# Altium project Circuits.PrjPcb
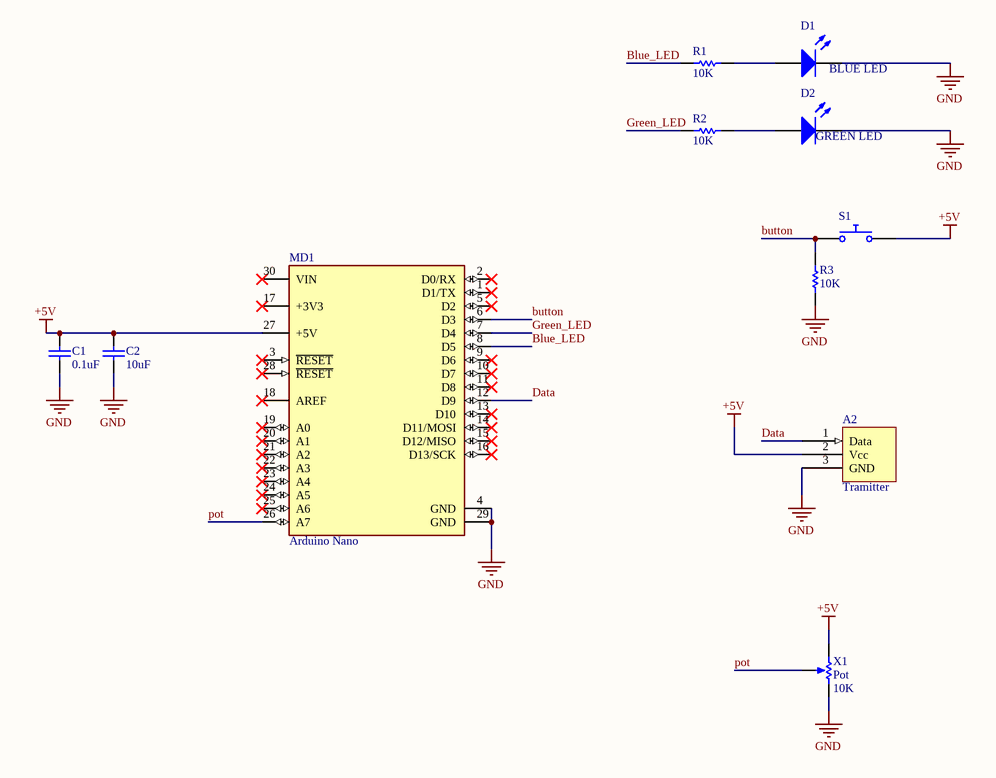
[diagram p0: transmitter.SchDoc]
1 sheet, 11 parts. Net scope: global (net labels, ports and power ports of the same name join across sheets).

## Sheet transmitter.SchDoc
size A4; SheetNumber: 1; SheetTotal: 1

### Parts
A2  Tramitter
C1  value 0.1uF  (hidden comment: Capacitor)
C2  value 10uF  (hidden comment: Capacitor)
D1  BLUE LED
D2  GREEN LED
MD1  Arduino Nano  [FP-A000005-MFG]
R1  value 10K  (hidden comment: Resistor)
R2  value 10K  (hidden comment: Resistor)
R3  value 10K  (hidden comment: Resistor)
S1  Push Button Normally Opened  (value not drawn)
X1  Pot  value 10K

### Nets
+5V: A2.2(Vcc) C1.2 C2.2 MD1.27(+5V) S1.2 X1.1(TOP)
GND: A2.3(GND) C1.1 C2.1 D1.2(K) D2.2(K) MD1.4(GND) MD1.29(GND) R3.1 X1.2(BOT)
Blue_LED: MD1.8(D5) R1.1
button: MD1.6(D3) R3.2 S1.1
Data: A2.1(Data) MD1.12(D9)
Green_LED: MD1.7(D4) R2.1
pot: MD1.26(A7) X1.3(TAP)
NetD1_1: D1.1(A) R1.2
NetD2_1: D2.1(A) R2.2

Not connected (* = marked no-connect by the designer): MD1 1(D1/TX)* 2(D0/RX)* 3(~{RESET})* 5(D2)* 9(D6)* 10(D7)* 11(D8)* 13(D10)* 14(D11/MOSI)* 15(D12/MISO)* 16(D13/SCK)* 17(+3V3)* 18(AREF)* 19(A0)* 20(A1)* 21(A2)* 22(A3)* 23(A4)* 24(A5)* 25(A6)* 28(~{RESET})* 30(VIN)*

### Library data of the parts
A2 = Transmitter: 433MHz RF Transmitter Module
C1 C2 = Capacitor: SimulationGenericComponent: True
D1 D2 = LED: Light-Emitting Diode; AF: 1; BV: 0; BV_MAX: 1e99; EG: 1.11; FC: 0.5; IBV: 0.001; IS: 1e-14; MJSW: 0.33; NTUN: 30; TNOM: 27; XTI: 3; SimulationGenericComponent: True; CJO: 0; CJP: 0; CTA: 0; CTP: 0; FCS: 0.5; FV_MAX: 1e99; IKF: 0; IKR: 0; ISR: 1e-14; JSW: 0; JTUN: 0; JTUNSW: 0; KEG: 1; KF: 0; LEVEL: 1; N: 1; NBV: 1; NR: 1; NS: 1; PHP: 1; RS: 0; TCV: 0; TLEV: 0; TLEVC: 0; TM1: 0; TM2: 0; TPB: 0; TPHP: 0; TRS: 0; TRS2: 0; TT: 0; TTT1: 0; TTT2: 0; VJ: 1; XTITUN: 3
MD1 = CMP-189986-000002-1: ARDUINO NANO ATMEGA328 EVAL BRD; Number of Bits: 8; Evaluation Kit: Yes; Operating Supply Voltage: 12V; Interface: I2C; Data Bus Width: 8b; Core Architecture: AVR; Packaging: Bulk; Length: 7inch; Package Quantity: 50; Width: 5inch; REACH SVHC: No SVHC; Weight: 0.358383oz; Series: AVR® ATmega; Height: 0.25inch
R1-R3 = Resistor: TC1: 0; SimulationGenericComponent: True; TC2: 0
S1 = Push Button NO: closed: 0; Rclosed: 1m; Ropen: 1Meg; SimulationGenericComponent: True
X1 = Potentiometer: position: 0.5; SimulationGenericComponent: True